# EAGLE design IRTx (EAGLE 9.5.1)
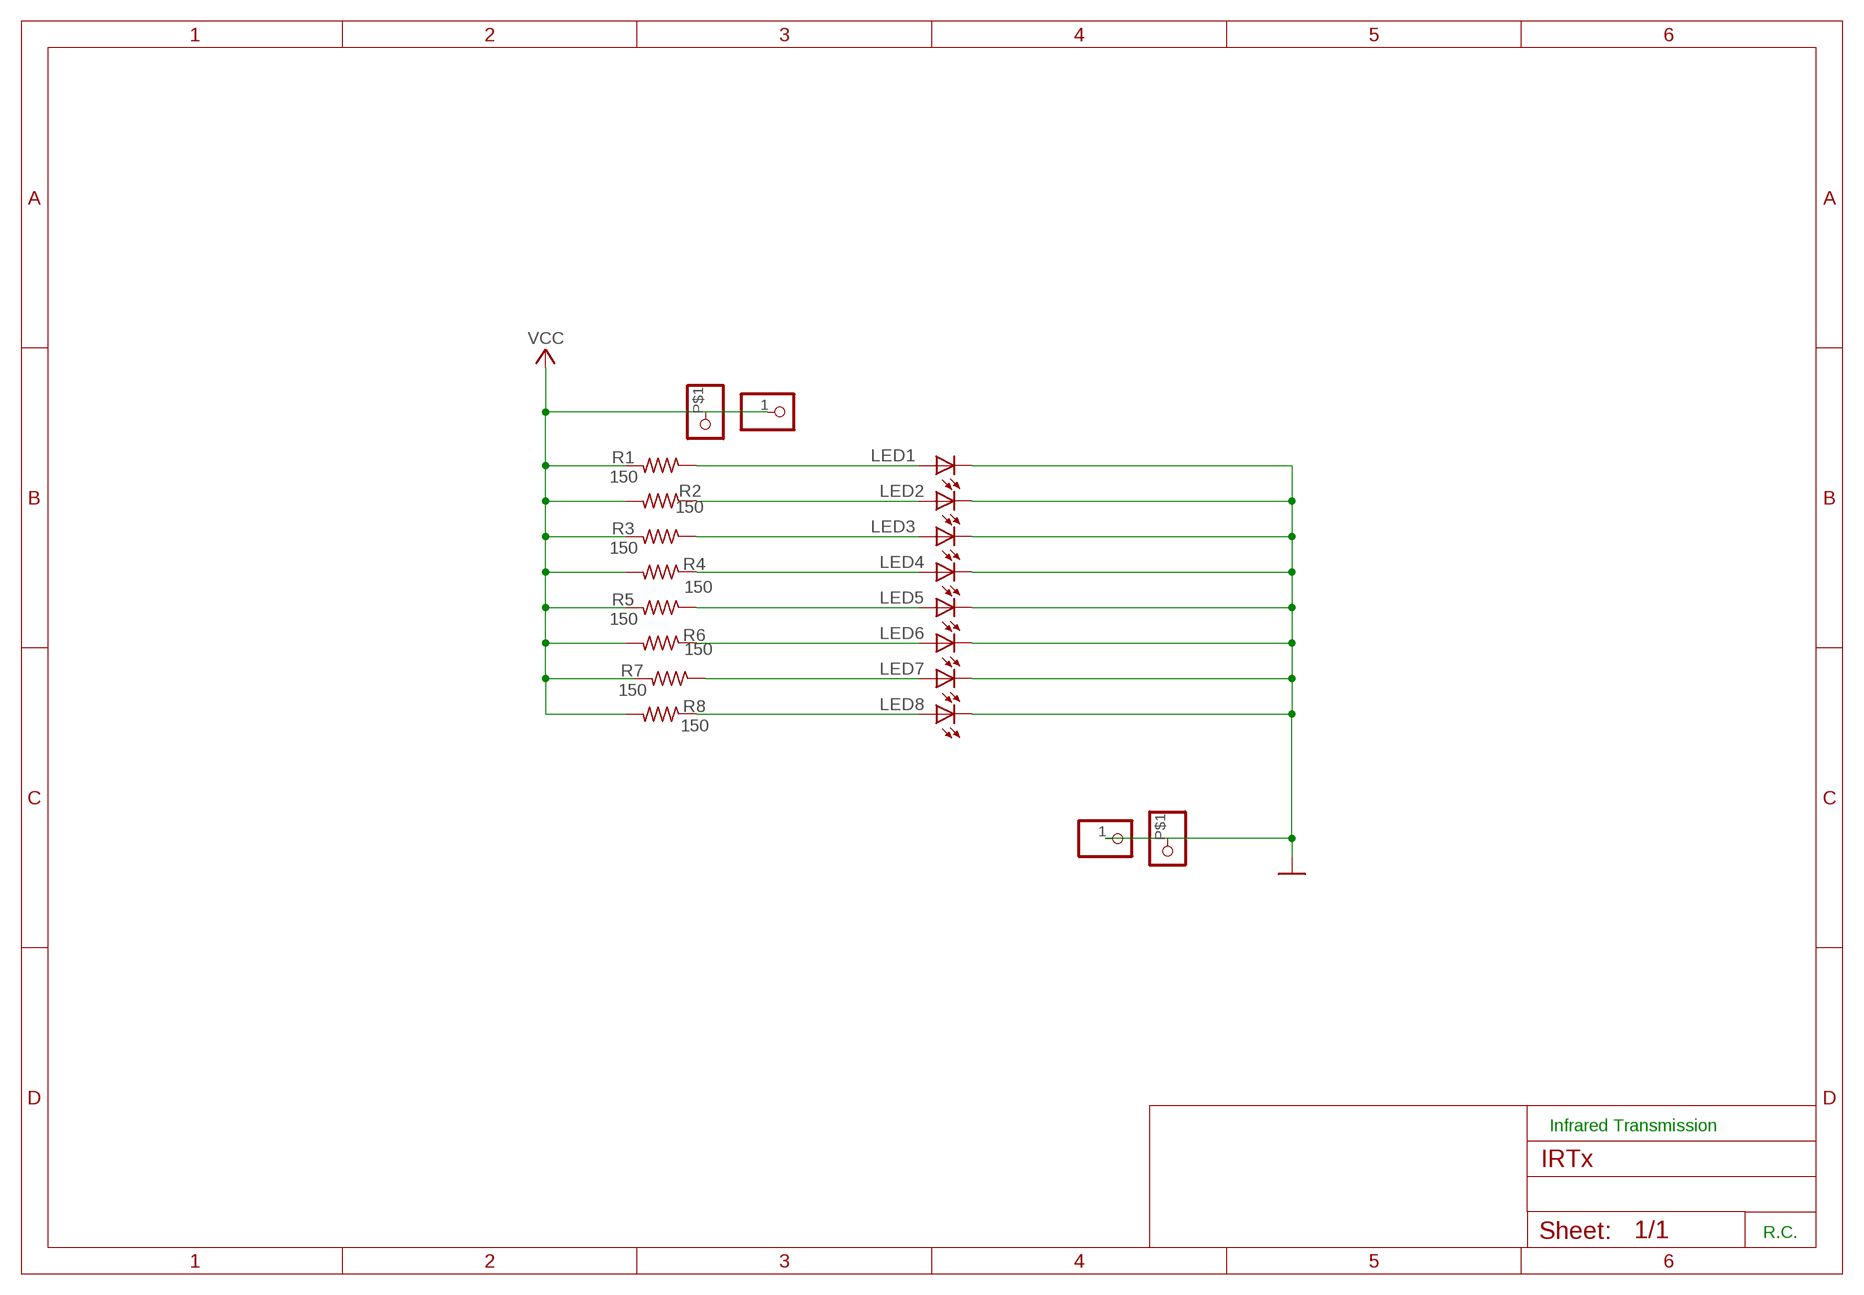
[diagram p0: schematic, sheet 1]

## Parts
JP1  3.3  PINHD-1X1-BIGPOGO  [1X1-BIGPOGO]
JP2  GND  PINHD-1X1-BIGPOGO  [1X1-BIGPOGO]
JP3  PINHD-1X1  [1X01]
JP4  PINHD-1X1  [1X01]
LED1  LED5MM  [LED5MM]
LED2  LED5MM  [LED5MM]
LED3  LED5MM  [LED5MM]
LED4  LED5MM  [LED5MM]
LED5  LED5MM  [LED5MM]
LED6  LED5MM  [LED5MM]
LED7  LED5MM  [LED5MM]
LED8  LED5MM  [LED5MM]
R1  150  R-US_0207/10  [0207/10]
R2  150  R-US_0207/10  [0207/10]
R3  150  R-US_0207/10  [0207/10]
R4  150  R-US_0207/10  [0207/10]
R5  150  R-US_0207/10  [0207/10]
R6  150  R-US_0207/10  [0207/10]
R7  150  R-US_0207/10  [0207/10]
R8  150  R-US_0207/10  [0207/10]

## Nets
GND: JP2.P$1 JP4.1 LED1.K(C) LED2.K(C) LED3.K(C) LED4.K(C) LED5.K(C) LED6.K(C) LED7.K(C) LED8.K(C)
N$1: LED2.A R2.1
N$2: LED1.A R1.1
N$3: LED3.A R3.1
N$4: LED4.A R4.1
N$5: LED5.A R5.1
N$6: LED6.A R6.1
N$7: LED7.A R7.1
N$8: LED8.A R8.1
VCC: JP1.P$1 JP3.1 R1.2 R2.2 R3.2 R4.2 R5.2 R6.2 R7.2 R8.2

## Notes on the sheet
- Infrared Transmission
- R.C.

## Library data of the parts
JP1-JP4 = adafruit:PINHD-1X1: Pin header 1x1 for 0.1" spacing With round pins
LED1-LED8 = adafruit:LED: LED OSRAM: - CHIPLED LG R971, LG N971, LY N971, LG Q971, LY Q971, LO R971, LY R971 LH N974, LH R974 LS Q976, LO Q976, LY Q976 LO Q996 - Hyper CHIPLED LW Q18S LB Q993, LB Q99A, LB R99A - SideLED LS A670, LO A670, LY A670, LG A670, LP A670 LB A673, LV A673, LT A673, LW A673 LH A674 LY A675 LS A676, LA A676, LO A676, LY A676, LW A676 LS A679, LY A679, LG A679 - Hyper Micro SIDELED® LS Y876, LA Y876, LO Y876, LY Y876 LT Y87S - SmartLED LW L88C, LW L88S LB L89C, LB L89S, LG L890 LS L89K, LO L89K, LY L89K LS L896, LA L896, LO L896, LY L896 - TOPLED LS T670, LO T670, LY T670, LG T670, LP T670 LSG T670, LSP T670, LSY T670, LOP T670, LYG T670 LG T671, LOG T671, LSG T671 LB T673, LV T673, LT T673, LW T673 LH T674 LS T676, LA T676, LO T676, LY T676, LB T676, LH T676, LSB T676, LW T676 LB T67C, LV T67C, LT T67C, LS T67K, LO T67K, LY T67K, LW E67C LS E67B, LA E67B, LO E67B, LY E67B, LB E67C, LV E67C, LT E67C LW T67C LS T679, LY T679, LG T679 LS T770, LO T770, LY T770, LG T770, LP T770 LB T773, LV T773, LT T773, LW T773 LH T774 LS E675, LA E675, LY E675, LS T675 LS T776, LA T776, LO T776, LY T776, LB T776 LHGB T686 LT T68C, LB T68C - Hyper Mini TOPLED® LB M676 - Mini TOPLED Santana® LG M470 LS M47K, LO M47K, LY M47K Source: http://www.osram.convergy.de/
R1-R8 = adafruit:R-US_: RESISTOR, American symbol

## Board
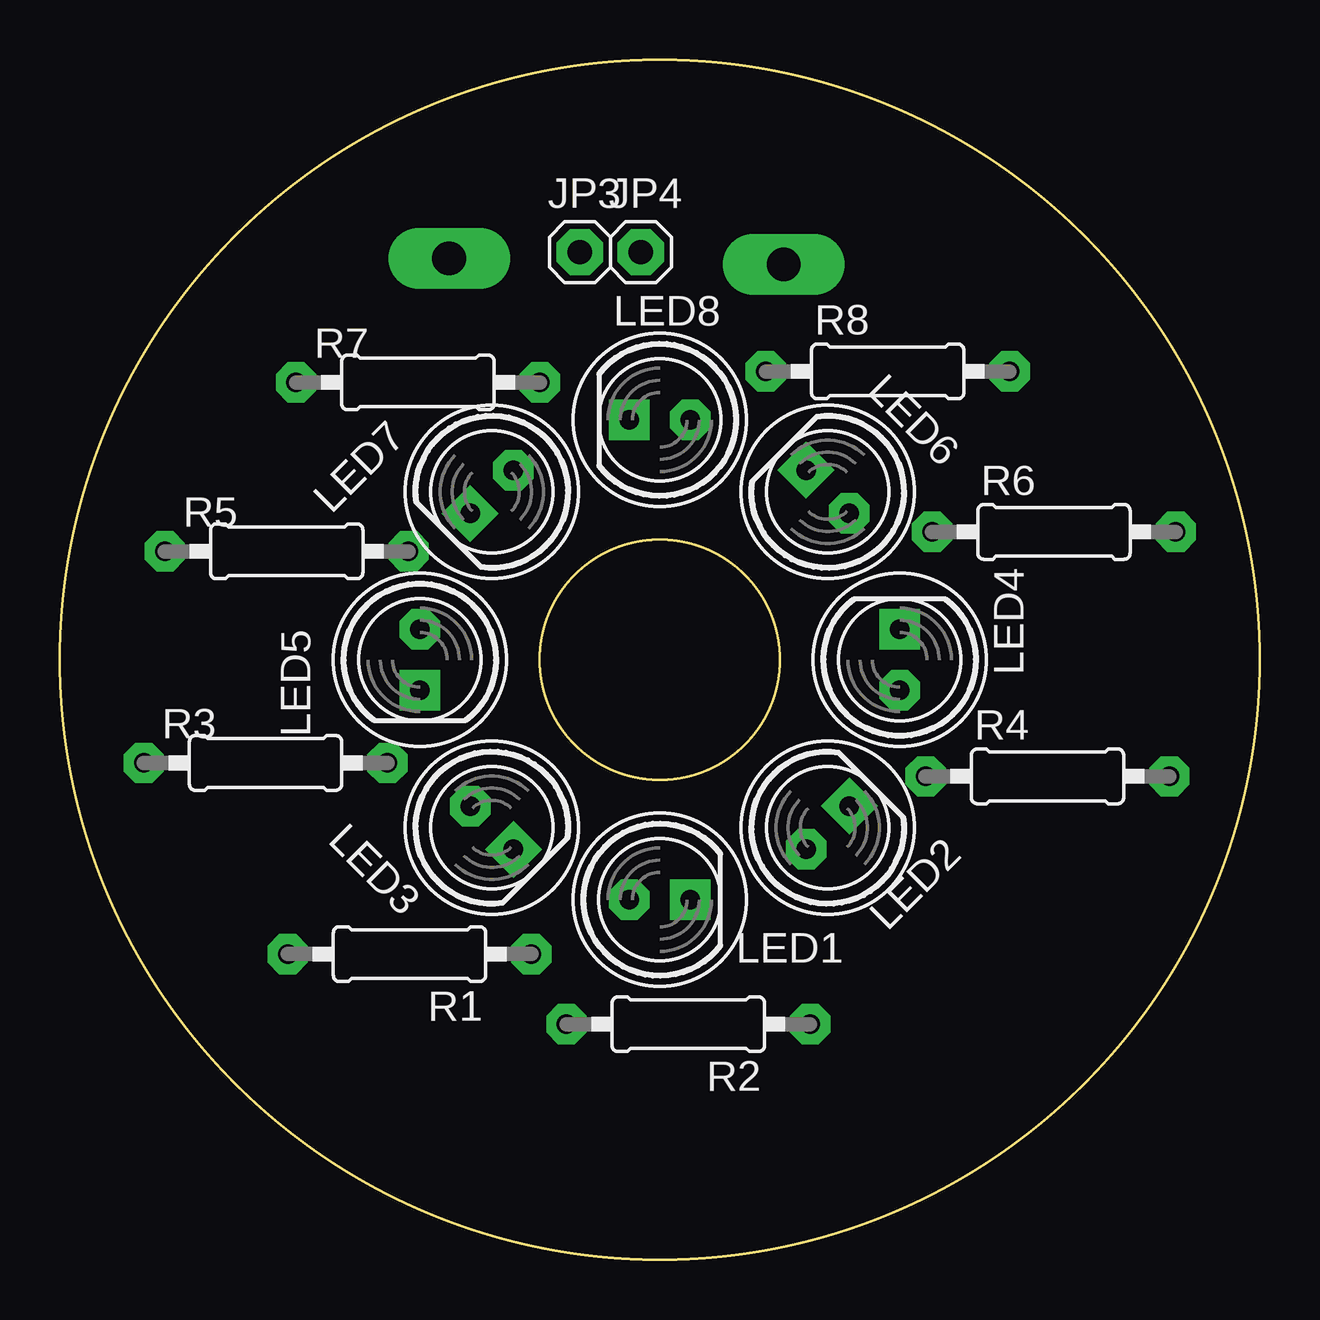
[diagram p1: board, top side]
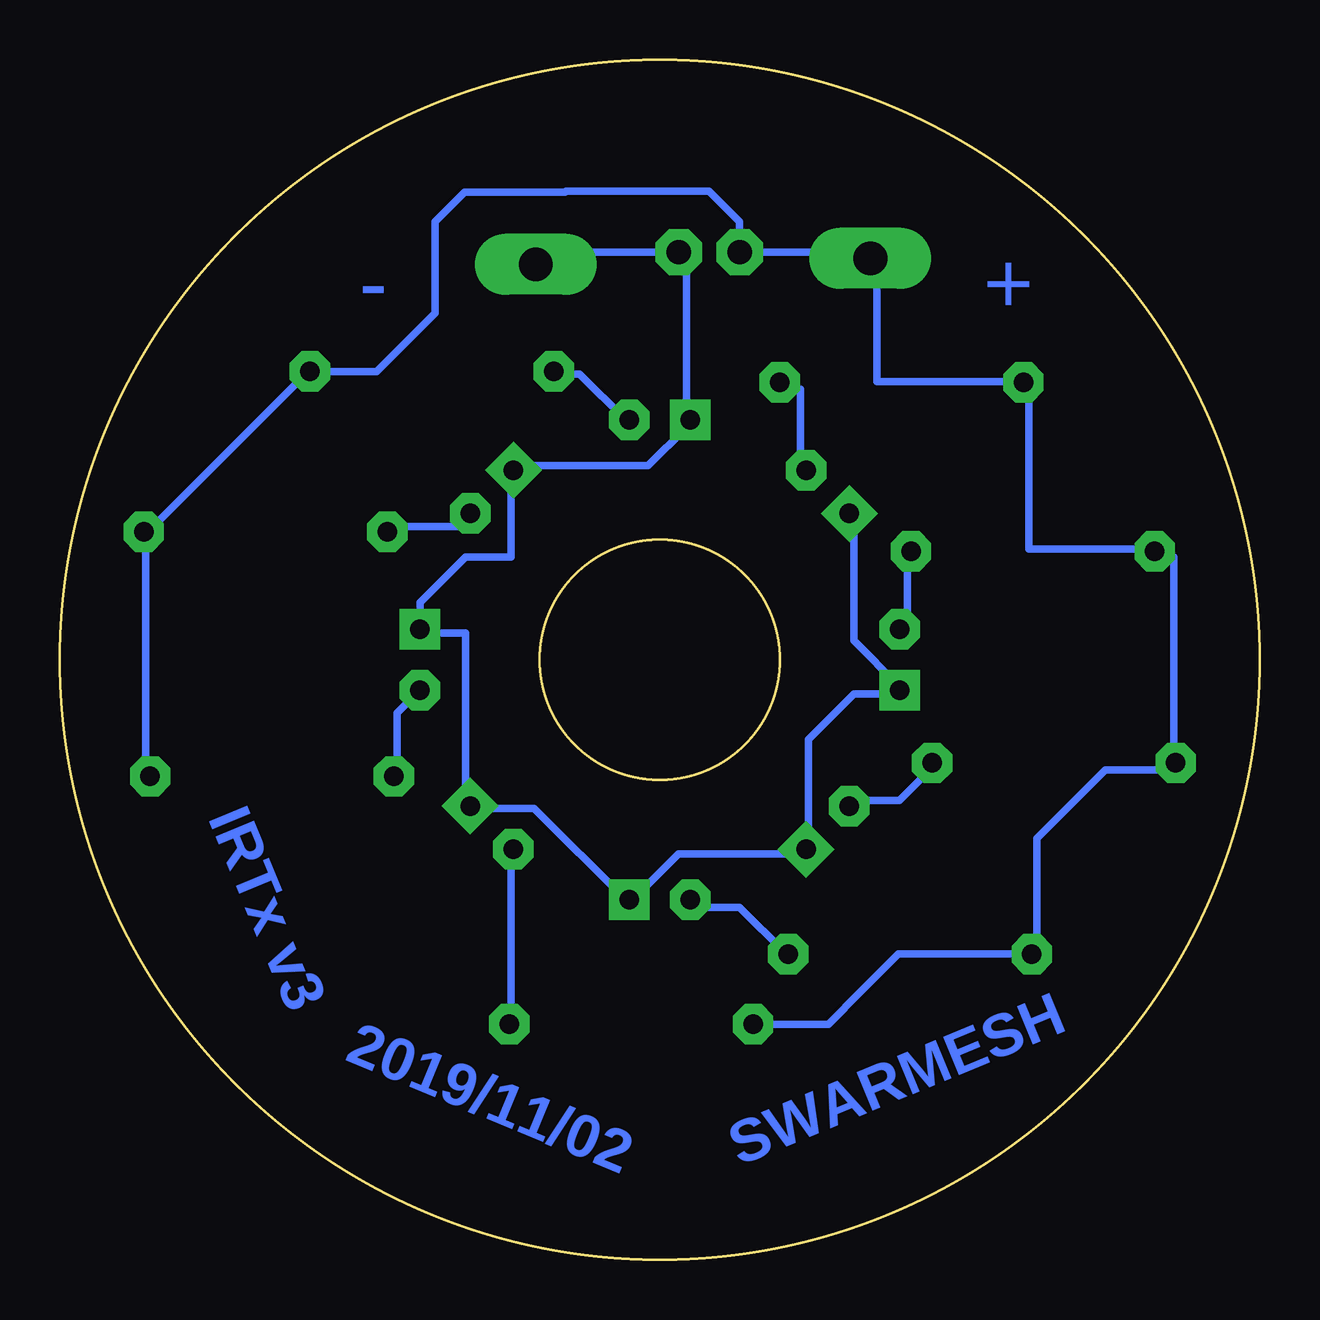
[diagram p2: board, bottom side, seen from below]

Size 50 x 50 mm. Coordinates in mm from the lower left corner, seen from the top.
Outline: circle at 25,25 radius 25
Outline: circle at 25,25 radius 5
Copper layers (1*16): Top 0.035mm / dielectric 1.5mm / Bottom 0.035mm
Design rules "default *": minimum track width 12mil, minimum drill 0.35mm, track to track 12mil, track to pad 12mil, pad to pad 12mil, via to via 12mil, smd to smd 6mil, copper to edge 40mil, drill to drill 12mil, minimum pad ring 10mil, minimum via ring 8mil, stop-mask expansion 4mil, vias tented up to drill 0mil, thermal gap 10mil

### Footprints (pad centres in the part's own frame; a part is rotated, then mirrored left to right if it is on the bottom)
1X1-BIGPOGO = drill 1.4 pad 2.54 long: P$1 0,0
1X01 = drill 1.016 pad 1.93 octagon: 1 0,0
LED5MM = drill 0.813 pad 1.676 octagon: A -1.27,0 | drill 0.813 pad 1.676 square: K 1.27,0
0207/10 = drill 0.813 pad 1.676 octagon: 1 -5.08,0; 2 5.08,0

### Placement (x,y rotation side)
JP1  16.22,41.73 0 top
JP2  30.17,41.48 0 top
JP3  21.67,41.99 0 top
JP4  24.21,41.99 0 top
LED1  25,15 0 top
LED2  32,18 45 top
LED3  18,18 315 top
LED4  35,25 90 top
LED5  15,25 270 top
LED6  32,32 135 top
LED7  18,32 225 top
LED8  25,35 180 top
R1  14.57,12.73 180 top
R2  26.19,9.81 180 top
R3  8.57,20.7 180 top
R4  41.16,20.14 0 top
R5  9.45,29.52 180 top
R6  41.43,30.33 0 top
R7  14.92,36.56 180 top
R8  34.5,37.02 0 top

### Tracks (layer width: path | path; a pad name or v marks a point on that pad's centre or on a via)
GND
  Bottom 0.305: LED7.K 16.91,30.88 16.91,25.8 15,23.89 LED5.K 15,23.57 16.91,23.57 18.81,21.67 18.81,17.23 LED3.K 19.13,16.91 24.21,16.91 26.11,15 LED1.K 26.43,15 30.24,18.81 32.78,18.81 LED2.K 33.1,19.13 33.1,24.84 33.1,26.11 34.69,26.11 LED4.K 35,27.39 33.1,29.29 31.2,29.29 31.2,32.78 LED6.K 30.88,33.1 25.48,33.1 23.89,34.69 LED8.K 23.89,35.01 23.89,41.99 JP4.1 29.61,41.99 29.92,41.67 JP2.P$1
N$1
  Bottom 0.305: R2.1 31.2,9.92 31.2,16.91 LED2.A
N$2
  Bottom 0.305: R1.1 19.77,12.78 21.67,14.68 23.57,14.68 LED1.A
N$3
  Bottom 0.305: R3.1 13.73,20.4 15,19.13 16.91,19.13 LED3.A
N$4
  Bottom 0.305: R4.1 35.96,20.4 35.96,22.77 LED4.A
N$5
  Bottom 0.305: LED5.A 14.68,26.43 14.68,29.29 R5.1
N$6
  Bottom 0.305: LED6.A 33.1,30.88 33.42,30.56 36.27,30.56 R6.1
N$7
  Bottom 0.305: LED7.A 19.13,33.1 19.13,36.27 19.77,36.27 R7.1
N$8
  Bottom 0.305: LED8.A 26.43,35.01 28.34,36.91 29.29,36.91 R8.1
VCC
  Bottom 0.305: R4.2 46.44,20.4 46.44,30.24 R6.2 46.44,30.56 46.12,30.56 39.77,36.91 R8.2 36.8,37.02 34.37,39.45 34.37,43.26 33.13,44.5 28.95,44.5 28.91,44.53 22.94,44.53 21.67,43.26 JP3.1 16.27,41.99 JP1.P$1 15.95,41.67 15.95,36.59 9.92,36.59 R7.2 9.61,36.27 9.61,29.61 4.53,29.61 R5.2 4.21,29.29 3.57,29.29 3.57,20.72 R3.2 3.57,20.4 6.43,20.4 9.29,17.54 9.29,12.78 R1.2 | 9.61,12.46 R1.2 | R2.2 17.97,9.81 16.59,11.19 15.05,12.73 R1.2

### Text on the board
Bottom: + | - | IRTx v3 | 2019/11/02 | SWARMESH